# Altium project Synchronus_buck converter _ Altium.PrjPcb
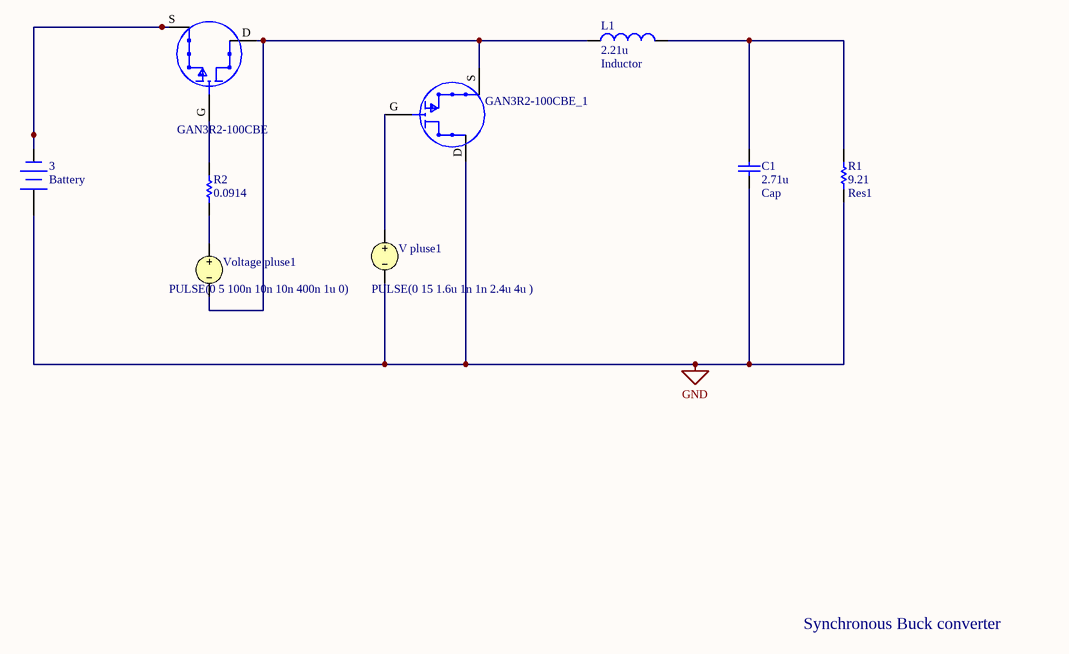
[diagram p0: Syn_buckconverter_Altium.SchDoc]
1 sheet, 9 parts. Net scope: global (net labels, ports and power ports of the same name join across sheets).
Board file: Syn_buckconverter_Altium.PcbDoc

## Sheet Syn_buckconverter_Altium.SchDoc
size A4; SheetNumber: 1; SheetTotal: 1

### Parts
1  GAN3R2-100CBE  [FP-WLCSP8-SOT8072-MFG]
2  GAN3R2-100CBE_1  [FP-WLCSP8-SOT8072-MFG]
3  Battery  [BAT-2]
C1  Cap  value 2.71u  [RAD-0.3]
L1  Inductor  value 2.21u  [0402-A]
R1  Res1  value 9.21  [AXIAL-0.3]
R2  value 0.0914  [AXIAL-0.3]  (hidden comment: Res1)
V_pluse1  PULSE(0 15 1.6u 1n 1n 2.4u 4u )
Voltage_pluse1  PULSE(0 5 100n 10n 10n 400n 1u 0)

### Nets
GND: 2.D 3.1(+) C1.1 R1.1 V_pluse1.2
Net1_D: 1.D 2.S L1.1 Voltage_pluse1.2
Net1_G: 1.G R2.2
Net1_S: 1.S 3.2(-)
Net2_G: 2.G V_pluse1.1
NetC1_2: C1.2 L1.2 R1.2
NetR2_1: R2.1 Voltage_pluse1.1

### Notes on the sheet
- Synchronous Buck converter

### Library data of the parts
1 2 = GAN3R2-100CBE: GAN3R2-100CBE                                                                       100 V, 3.2 mOhm Gallium Nitride (GaN) FET in a 3.5 mm x 2.13 mm Wafer Level Chip; NexarPartId: 136220986; Drain to Source Resistance: 2.4mΩ; Power Dissipation: 394W; Number of Channels: 1; Drain to Source Voltage (Vdss): 100V; Gate to Source Voltage (Vgs): -4V; Max Junction Temperature (Tj): 150°C; Continuous Drain Current (ID): 60A; Height: 464µm; Max Operating Temperature: 150°C; Min Operating Temperature: -40°C; Drain to Source Breakdown Voltage: 100V; MPN: GAN3R2-100CBE
3 = Battery: Multicell Battery; Published: 24-Mar-1999; LatestRevisionDate: 17-Jul-2002; LatestRevisionNote: Re-released for DXP Platform.; PackageReference: BAT-2; Publisher: Altium Limited; PackageDescription: Battery; 2 Leads
C1 = Cap: Capacitor; Published: 8-Jun-2000; LatestRevisionDate: 17-Jul-2002; LatestRevisionNote: Re-released for DXP Platform.; PackageReference: RAD-0.3; Publisher: Altium Limited; PackageDescription: Radial Cap, Thru-Hole; 2 Leads; 0.3 in Pin Spacing
L1 = Inductor: Code_IEC: 1005; Published: 8-Jun-2000; LatestRevisionDate: 29-May-2009; LatestRevisionNote: IPC-7351 Footprint Added.; PackageReference: 0402-A; Publisher: Altium Limited; PackageDescription: Chip Inductor; Code_JEITA: 0402
R1 R2 = Res1: Resistor; Published: 8-Jun-2000; LatestRevisionDate: 17-Jul-2002; LatestRevisionNote: Re-released for DXP Platform.; PackageReference: AXIAL-0.3; Publisher: Altium Limited; PackageDescription: Axial Device, Thru-Hole; 2 Leads; 0.3 in Pin Spacing
V_pluse1 = VSRC: Voltage Source; Note: PCB Footprint - Not required; AC Magnitude: 1; AC Phase: 0; DC Magnitude: 5; Time Delay: 100n; Rise Time: 10n; Pulse Width: 400n; Period: 1u; Published: 8-Jun-2000; LatestRevisionDate: 17-Jul-2002; LatestRevisionNote: Re-released for DXP Platform.; PackageReference: Not Applicable; Publisher: Altium Limited; Initial Value: 0; Pulsed Value: 5; Fall Time: 10n; Phase: 0
Voltage_pluse1 = VSRC: Voltage Source; Note: PCB Footprint - Not required; AC Magnitude: 1; AC Phase: 0; DC Magnitude: 5; Published: 8-Jun-2000; LatestRevisionDate: 17-Jul-2002; LatestRevisionNote: Re-released for DXP Platform.; PackageReference: Not Applicable; Publisher: Altium Limited; Initial Value: 0; Pulsed Value: 5; Time Delay: 100n; Rise Time: 10n; Fall Time: 10n; Pulse Width: 400n; Period: 1u; Phase: 0